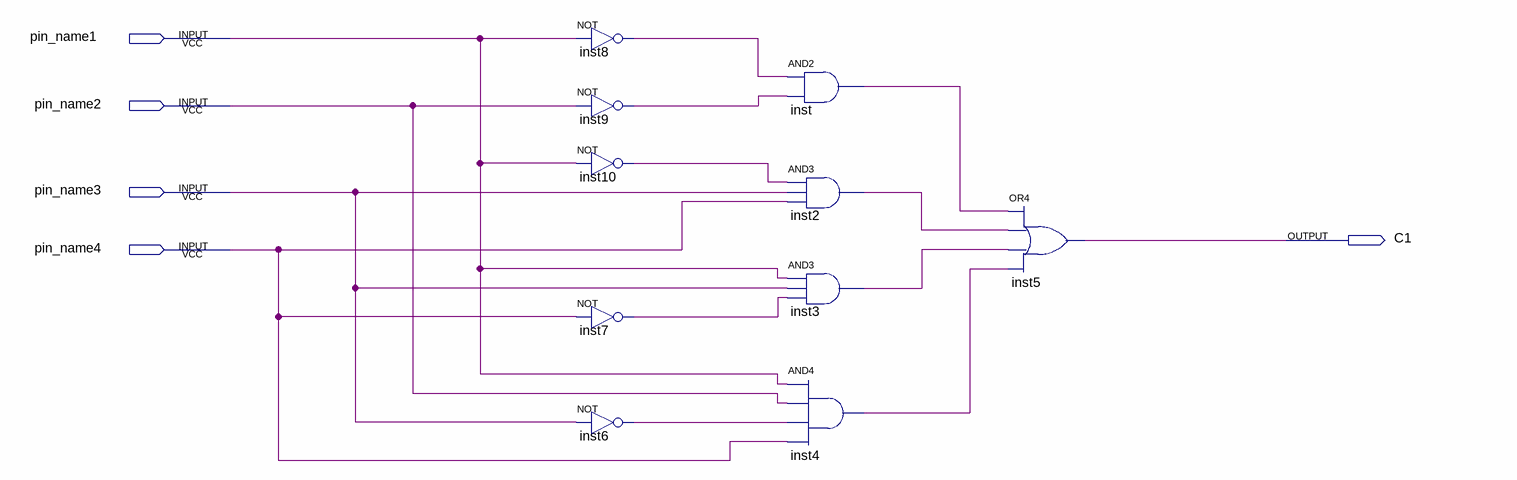
[diagram p0: schematic sheet]
// Quartus schematic C1.bdf as structural Verilog: 10 symbols, 5 pins
module C1 (
  input  pin_name1,
  input  pin_name2,
  input  pin_name3,
  input  pin_name4,
  output C1
);

  wire inst2_out, inst3_out, inst4_out, inst6_out, inst7_out, inst8_out, inst9_out, inst10_out, inst_out;

  not inst8 (inst8_out, pin_name1);
  not inst9 (inst9_out, pin_name2);
  not inst10 (inst10_out, pin_name1);
  not inst7 (inst7_out, pin_name4);
  not inst6 (inst6_out, pin_name3);
  and inst (inst_out, inst8_out, inst9_out);
  and inst2 (inst2_out, inst10_out, pin_name3, pin_name4);
  and inst3 (inst3_out, pin_name1, pin_name3, inst7_out);
  and inst4 (inst4_out, pin_name1, pin_name2, inst6_out, pin_name4);
  or inst5 (C1, inst_out, inst2_out, inst3_out, inst4_out);
endmodule
